# EAGLE board iMX233-OLINUXINO-MINI_Rev_C (EAGLE 7.2.0), part 1 of 3
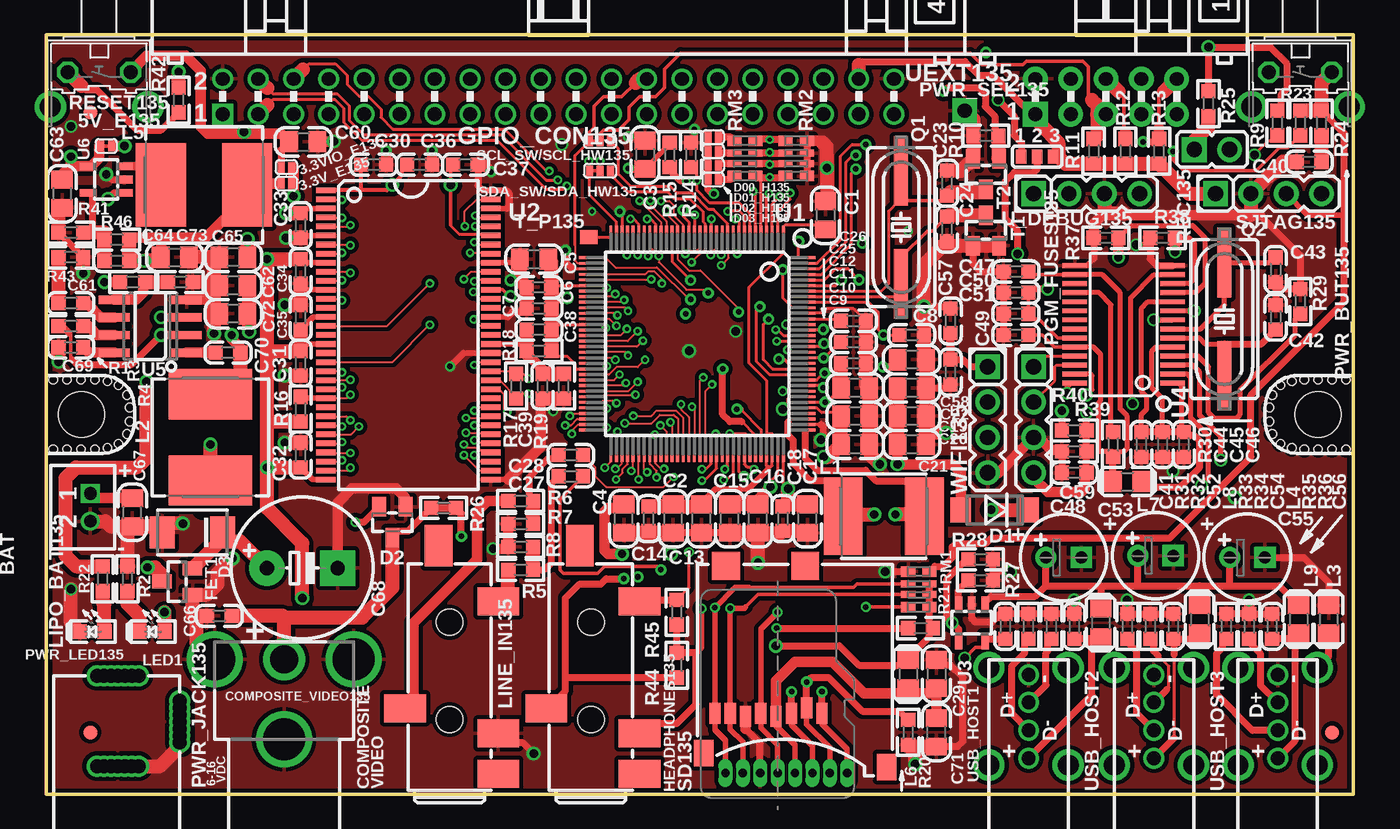
[diagram p1: board, top side]
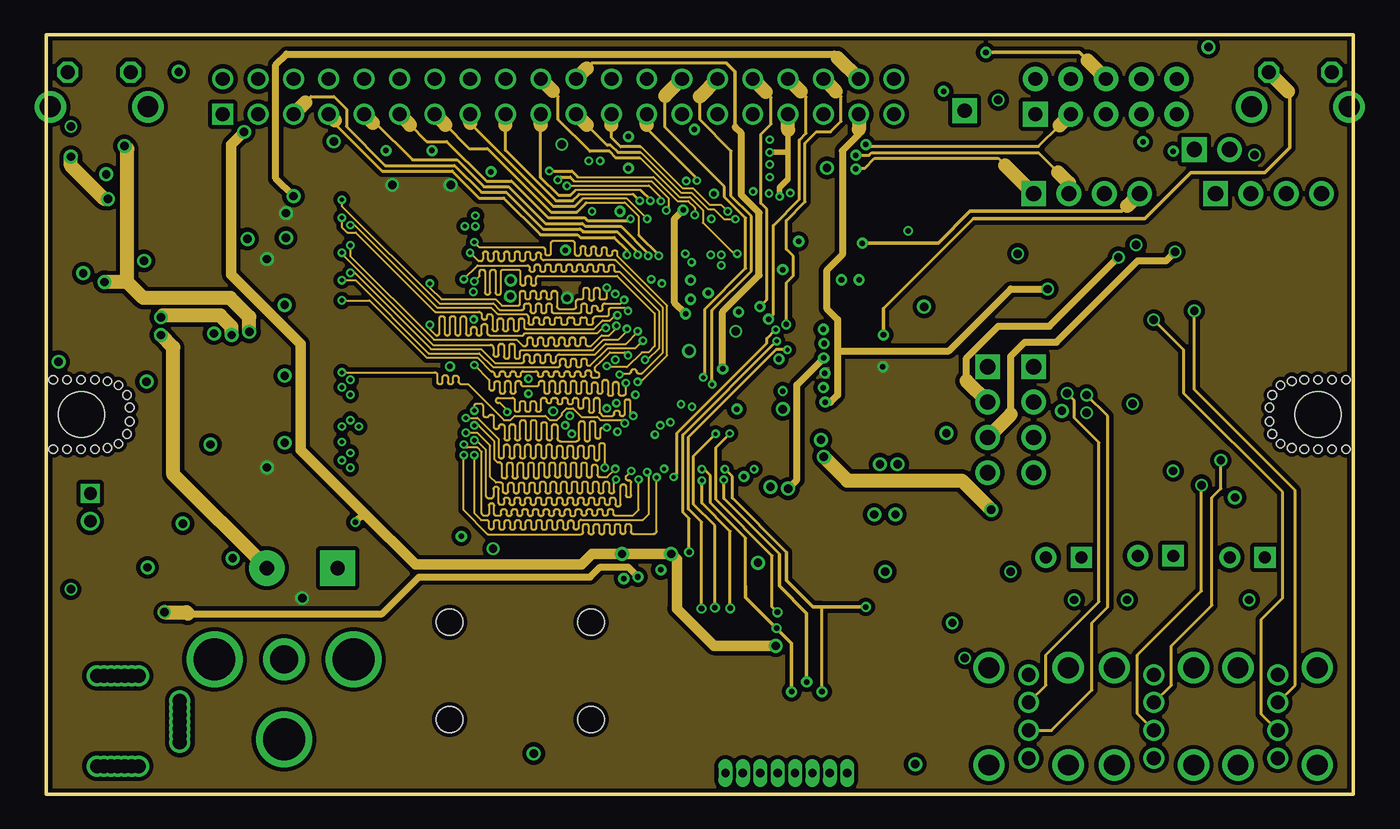
[diagram p2: board, inner layer Route2]
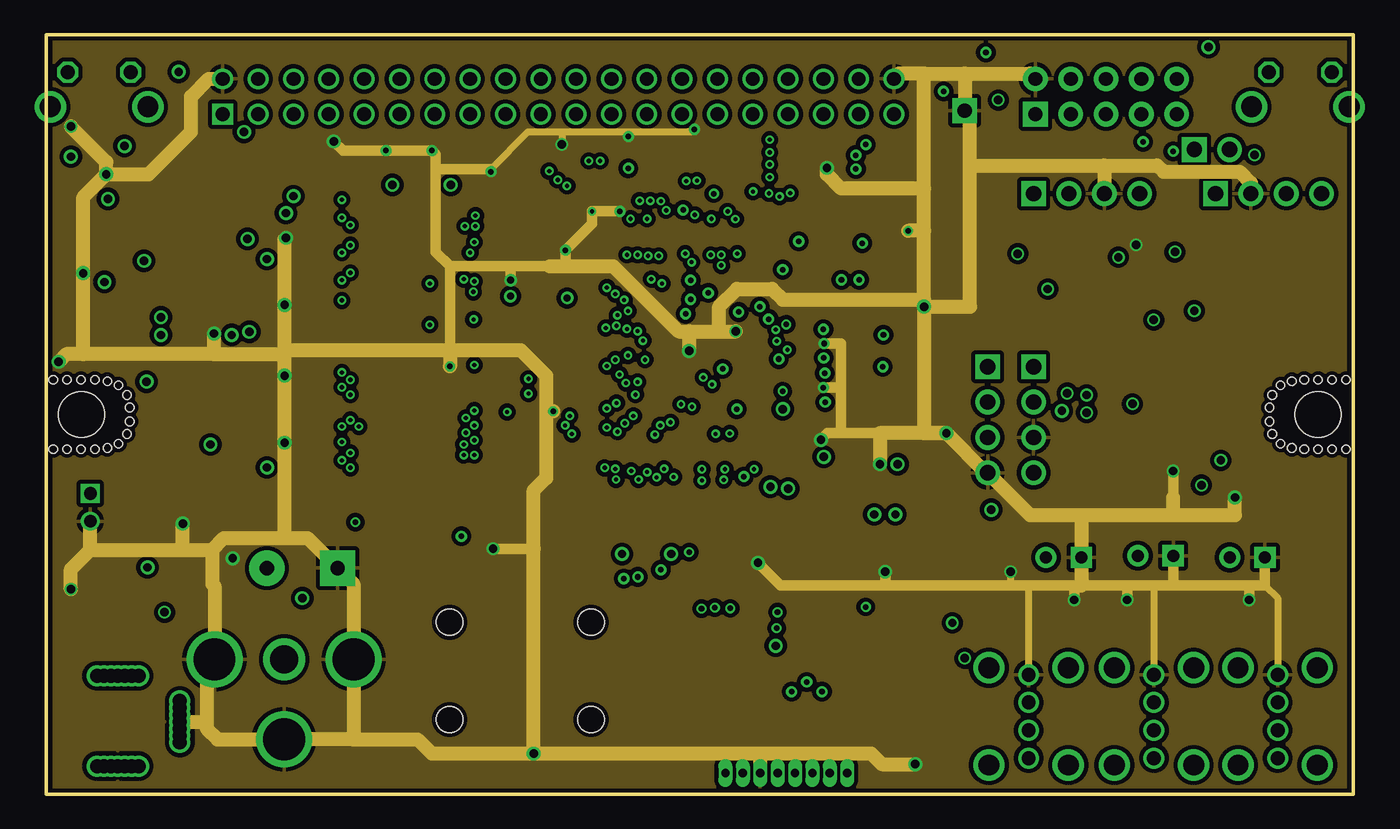
[diagram p3: board, inner layer Route15]
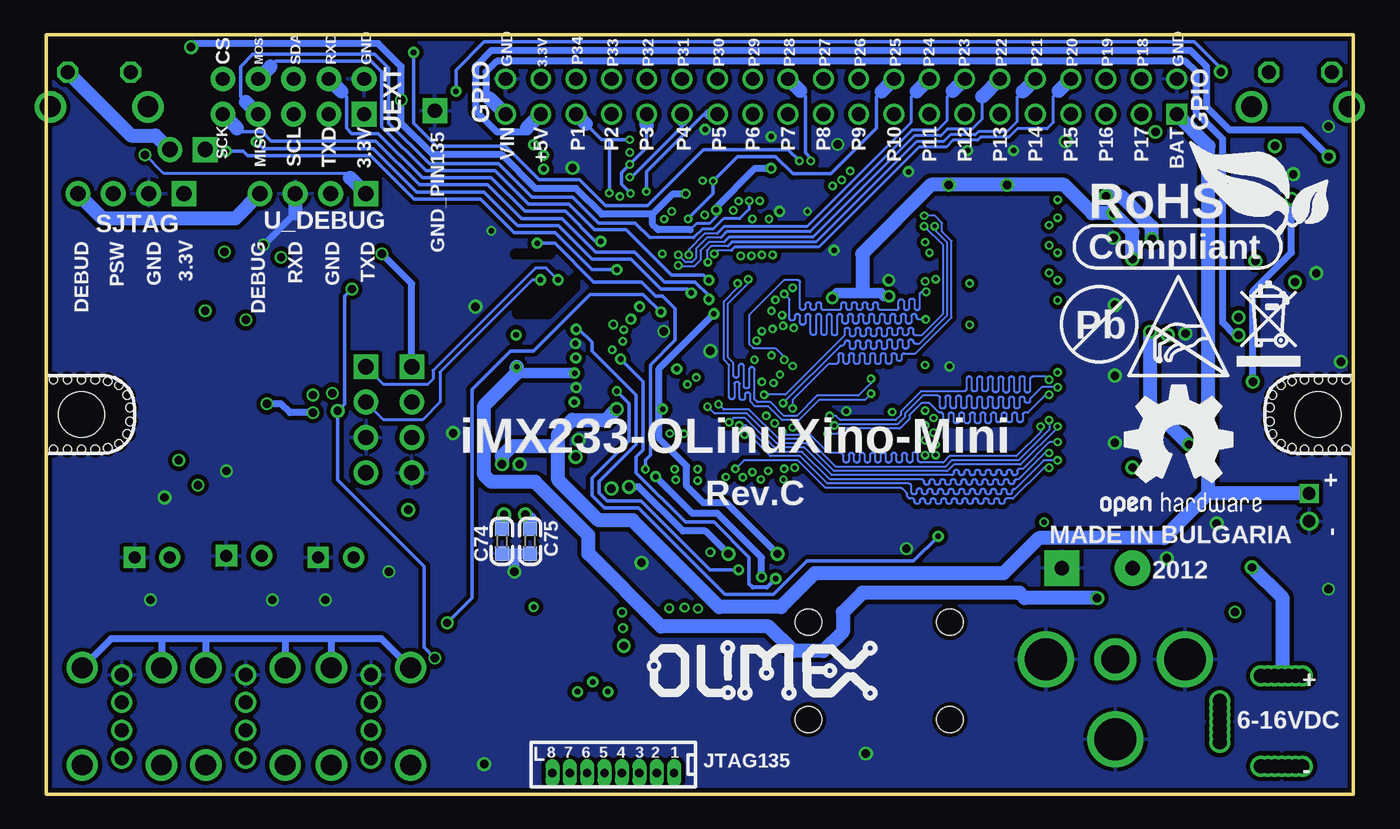
[diagram p4: board, bottom side, seen from below]

Size 93.98 x 54.61 mm. Coordinates in mm from the lower left corner, seen from the top.
Copper layers (1*2*15*16): Top 0.035mm / dielectric 0.5mm / Route2 0.035mm / dielectric 0.5mm / Route15 0.035mm / dielectric 0.5mm / Bottom 0.035mm
Design rules "default": minimum track width 6mil, minimum drill 0.3mm, track to track 0.1499mm, track to pad 6mil, pad to pad 6mil, via to via 6mil, smd to smd 1mil, copper to edge 10mil, drill to drill 8mil, minimum pad ring 6mil, minimum via ring 6mil, stop-mask expansion 4mil, vias tented up to drill 25mil, thermal gap 12mil
Net classes: 1 pwr: width 0.5 mm, clearance 0.2 mm
tRestrict: 6 lines
bRestrict: 4 lines

## Footprints (pad centres in the part's own frame; a part is rotated, then mirrored left to right if it is on the bottom)
SJ_1_SMALLER = smd 0.508 x 0.762: 1 -0.381,0; 2 0.381,0
SJ_1_SMALLER_CLOSE = smd 0.508 x 0.762: 1 -0.381,0; 2 0.381,0
C0805_5MIL_DWS = smd 1.27 x 1.524: 1 -1.016,0; 2 1.016,0
C0603_DWS = smd 1.016 x 1.016: 1 -0.889,0; 2 0.889,0
E2,5-6,3 = drill 0.864 pad 1.524: + -1.27,0 | drill 0.864 pad 1.524 square: - 1.27,0
E5-10,5 = drill 1.016 pad 2.54: + -2.54,0 | drill 1.016 pad 2.54 square: - 2.54,0
VIDEO_CON = drill 3: GND1 -5,-5.75; GND2 0,0; GND3 5,-5.75 | drill 2: IO 0,-5.75
MLL-41 = smd 1.45 x 1.8: A 2.445,0; K -2.445,0
SOT23C(BAT54S) = smd 1 x 1.4: 1 -0.95,-1.1; 2 0.95,-1.1; 3 0,1.1
DO214AA = smd 1.778 x 2.286: A 2.177,0; C -2.177,0
SOT23 = smd 1 x 1.4: 1 -0.95,-1.1; 2 0.95,-1.1; 3 0,1.1
TEST_PAD40/70/SQUARE = drill 1.016 pad 1.778 square: P$1 0,0
BH40R = drill 1 square: 1 -24.13,-1.27 | drill 1: 2 -24.13,1.27; 3 -21.59,-1.27; 4 -21.59,1.27; 5 -19.05,-1.27; 6 -19.05,1.27; 7 -16.51,-1.27; 8 -16.51,1.27; 9 -13.97,-1.27; 10 -13.97,1.27; 11 -11.43,-1.27; 12 -11.43,1.27; 13 -8.89,-1.27; 14 -8.89,1.27; 15 -6.35,-1.27; 16 -6.35,1.27; 17 -3.81,-1.27; 18 -3.81,1.27; 19 -1.27,-1.27; 20 -1.27,1.27; 21 1.27,-1.27; 22 1.27,1.27; 23 3.81,-1.27; 24 3.81,1.27; 25 6.35,-1.27; 26 6.35,1.27; 27 8.89,-1.27; 28 8.89,1.27; 29 11.43,-1.27; 30 11.43,1.27; 31 13.97,-1.27; 32 13.97,1.27; 33 16.51,-1.27; 34 16.51,1.27; 35 19.05,-1.27; 36 19.05,1.27; 37 21.59,-1.27; 38 21.59,1.27; 39 24.13,-1.27; 40 24.13,1.27
PJ-W47S-05D2-LF_5PIN_V2 = smd 2 x 3: 1 2.1,-0.5; 2 14.5,-0.5; 3 6.8,6.2; 5 5,-0.5 | smd 3 x 2: 4 18.5,3.8 | hole 1.9: 6,3; 13,3
WU08S = drill 0.6 pad 0.991 long: 1 -4.375,0; 2 -3.125,0; 3 -1.875,0; 4 -0.625,0; 5 0.625,0; 6 1.875,0; 7 3.125,0; 8 4.375,0
CD53 = smd 2.794 x 5.588: 1 -2.921,0; 2 2.921,0
8X8MM_3131 = smd 3.6 x 6: 1 -3.1,0; 2 3.1,0
L0805_5MIL_DWS = smd 1.27 x 1.524: 1 -1.016,0; 2 1.016,0
LED-0603 = smd 1.016 x 1.016: A 0.889,0; C -0.889,0
DW02S = drill 0.9 square: 1 -1,0 | drill 0.9: 2 1,0
HN1X4 = drill 1.1 pad 1.778 square: 1 -3.81,0 | drill 1.1 pad 1.778: 2 -1.27,0; 3 1.27,0; 4 3.81,0
B3F-31XX = drill 1.016 octagon: 1 -2.261,-1.245; 2 2.261,-1.245 | drill 1.499 pad 2.159: 3 -3.505,1.245; 4 3.505,1.245
PWR_JACK_UNI_MILLING = drill 1: + 0,4.75; +1 0,5.25; +2 0,5.75; +3 0,6.25; +4 0,4.25; +5 0,3.75; +6 0,3.25; - -6.5,4.75; -1 -6.5,5.25; -2 -6.5,5.75; -3 -6.5,4.25; -4 -6.5,3.75; -5 -6.5,6.25; -6 -6.5,3.25; -- -3.3,0.3; --1 -3.8,0.3; --2 -4.3,0.3; --3 -4.8,0.3; --4 -2.8,0.3; --5 -2.3,0.3; --6 -1.8,0.3
SJ_2_SMALL = smd 0.762 x 1.016: 1 -1.143,0; 2 0,0; 3 1.143,0
HC49/SMD2_THIN = smd 5 x 1: 1 -4.064,0; 2 4.064,0
R0603_5MIL_DWS = smd 1.016 x 1.016: 1 -0.889,0; 2 0.889,0
R0603_5MIL_DWS_NA = smd 1.016 x 1.016: 1 -0.889,0; 2 0.889,0
0603_0R = smd 1.016 x 1.016: 1 -0.889,0; 2 0.889,0
JP1 = drill 1.1 pad 1.778 square: 1 0,-1.27 | drill 1.1 pad 1.778: 2 0,1.27
R_MATRIX_4 = smd 1.016 x 0.762: 1.1 -0.762,1.27; 1.2 0.762,1.27; 4.1 -0.762,-1.27; 4.2 0.762,-1.27 | smd 1.016 x 0.508: 2.1 -0.762,0.381; 2.2 0.762,0.381; 3.1 -0.762,-0.381; 3.2 0.762,-0.381
SJ_2_SMALLER = smd 0.508 x 0.762: 1 -0.762,0; 2 0,0; 3 0.762,0
TFR-MEM-CON = smd 0.8 x 1.5: 1 -3.2,10.7; 2 -2.1,10.3; 3 -1,10.7; 4 0.1,10.9; 5 1.2,10.7; 6 2.3,10.9; 7 3.4,10.7; 8 4.5,10.7 | smd 2 x 2: 9 3.7,0.1; 10 -2,0.1 | smd 1.4 x 1.9: 11 5.3,13.55; 12 -7.85,14.55
SMD50/40 = smd 1.27 x 1.016: P$1 0,0
TQFP128LD = smd 0.2 x 1.5: 1 -6.2,-7.75; 2 -5.8,-7.75; 3 -5.4,-7.75; 4 -5,-7.75; 5 -4.6,-7.75; 6 -4.2,-7.75; 7 -3.8,-7.75; 8 -3.4,-7.75; 9 -3,-7.75; 10 -2.6,-7.75; 11 -2.2,-7.75; 12 -1.8,-7.75; 13 -1.4,-7.75; 14 -1,-7.75; 15 -0.6,-7.75; 16 -0.2,-7.75; 17 0.2,-7.75; 18 0.6,-7.75; 19 1,-7.75; 20 1.4,-7.75; 21 1.8,-7.75; 22 2.2,-7.75; 23 2.6,-7.75; 24 3,-7.75; 25 3.4,-7.75; 26 3.8,-7.75; 27 4.2,-7.75; 28 4.6,-7.75; 29 5,-7.75; 30 5.4,-7.75; 31 5.8,-7.75; 32 6.2,-7.75; 65 6.2,7.75; 66 5.8,7.75; 67 5.4,7.75; 68 5,7.75; 69 4.6,7.75; 70 4.2,7.75; 71 3.8,7.75; 72 3.4,7.75; 73 3,7.75; 74 2.6,7.75; 75 2.2,7.75; 76 1.8,7.75; 77 1.4,7.75; 78 1,7.75; 79 0.6,7.75; 80 0.2,7.75; 81 -0.2,7.75; 82 -0.6,7.75; 83 -1,7.75; 84 -1.4,7.75; 85 -1.8,7.75; 86 -2.2,7.75; 87 -2.6,7.75; 88 -3,7.75; 89 -3.4,7.75; 90 -3.8,7.75; 91 -4.2,7.75; 92 -4.6,7.75; 93 -5,7.75; 94 -5.4,7.75; 95 -5.8,7.75; 96 -6.2,7.75 | smd 1.5 x 0.2: 33 7.75,-6.2; 34 7.75,-5.8; 35 7.75,-5.4; 36 7.75,-5; 37 7.75,-4.6; 38 7.75,-4.2; 39 7.75,-3.8; 40 7.75,-3.4; 41 7.75,-3; 42 7.75,-2.6; 43 7.75,-2.2; 44 7.75,-1.8; 45 7.75,-1.4; 46 7.75,-1; 47 7.75,-0.6; 48 7.75,-0.2; 49 7.75,0.2; 50 7.75,0.6; 51 7.75,1; 52 7.75,1.4; 53 7.75,1.8; 54 7.75,2.2; 55 7.75,2.6; 56 7.75,3; 57 7.75,3.4; 58 7.75,3.8; 59 7.75,4.2; 60 7.75,4.6; 61 7.75,5; 62 7.75,5.4; 63 7.75,5.8; 64 7.75,6.2; 97 -7.75,6.2; 98 -7.75,5.8; 99 -7.75,5.4; 100 -7.75,5; 101 -7.75,4.6; 102 -7.75,4.2; 103 -7.75,3.8; 104 -7.75,3.4; 105 -7.75,3; 106 -7.75,2.6; 107 -7.75,2.2; 108 -7.75,1.8; 109 -7.75,1.4; 110 -7.75,1; 111 -7.75,0.6; 112 -7.75,0.2; 113 -7.75,-0.2; 114 -7.75,-0.6; 115 -7.75,-1; 116 -7.75,-1.4; 117 -7.75,-1.8; 118 -7.75,-2.2; 119 -7.75,-2.6; 120 -7.75,-3; 121 -7.75,-3.4; 122 -7.75,-3.8; 123 -7.75,-4.2; 124 -7.75,-4.6; 125 -7.75,-5; 126 -7.75,-5.4; 127 -7.75,-5.8; 128 -7.75,-6.2
66TSOP-II = smd 0.4 x 1.4: 1 -10.4,-5.925; 2 -9.75,-5.925; 3 -9.1,-5.925; 4 -8.45,-5.925; 5 -7.8,-5.925; 6 -7.15,-5.925; 7 -6.5,-5.925; 8 -5.85,-5.925; 9 -5.2,-5.925; 10 -4.55,-5.925; 11 -3.9,-5.925; 12 -3.25,-5.925; 13 -2.6,-5.925; 14 -1.95,-5.925; 15 -1.3,-5.925; 16 -0.65,-5.925; 17 0,-5.925; 18 0.65,-5.925; 19 1.3,-5.925; 20 1.95,-5.925; 21 2.6,-5.925; 22 3.25,-5.925; 23 3.9,-5.925; 24 4.55,-5.925; 25 5.2,-5.925; 26 5.85,-5.925; 27 6.5,-5.925; 28 7.15,-5.925; 29 7.8,-5.925; 30 8.45,-5.925; 31 9.1,-5.925; 32 9.75,-5.925; 33 10.4,-5.925; 34 10.4,5.925; 35 9.75,5.925; 36 9.1,5.925; 37 8.45,5.925; 38 7.8,5.925; 39 7.15,5.925; 40 6.5,5.925; 41 5.85,5.925; 42 5.2,5.925; 43 4.55,5.925; 44 3.9,5.925; 45 3.25,5.925; 46 2.6,5.925; 47 1.95,5.925; 48 1.3,5.925; 49 0.65,5.925; 50 0,5.925; 51 -0.65,5.925; 52 -1.3,5.925; 53 -1.95,5.925; 54 -2.6,5.925; 55 -3.25,5.925; 56 -3.9,5.925; 57 -4.55,5.925; 58 -5.2,5.925; 59 -5.85,5.925; 60 -6.5,5.925; 61 -7.15,5.925; 62 -7.8,5.925; 63 -8.45,5.925; 64 -9.1,5.925; 65 -9.75,5.925; 66 -10.4,5.925
SOT23-5 = smd 0.55 x 1.2: 1 -0.95,-1.3; 2 0,-1.3; 3 0.95,-1.3; 4 0.95,1.3; 5 -0.95,1.3
SSOP28 = smd 0.35 x 1.75: 1 -4.225,-3.525; 2 -3.575,-3.525; 3 -2.925,-3.525; 4 -2.275,-3.525; 5 -1.625,-3.525; 6 -0.975,-3.525; 7 -0.325,-3.525; 8 0.325,-3.525; 9 0.975,-3.525; 10 1.625,-3.525; 11 2.275,-3.525; 12 2.925,-3.525; 13 3.575,-3.525; 14 4.225,-3.525; 15 4.225,3.525; 16 3.575,3.525; 17 2.925,3.525; 18 2.275,3.525; 19 1.625,3.525; 20 0.975,3.525; 21 0.325,3.525; 22 -0.325,3.525; 23 -0.975,3.525; 24 -1.625,3.525; 25 -2.275,3.525; 26 -2.925,3.525; 27 -3.575,3.525; 28 -4.225,3.525
SOIC8 = smd 0.6 x 2.2: 1 -1.905,-2.6; 2 -0.635,-2.6; 3 0.635,-2.6; 4 1.905,-2.6; 5 1.905,2.6; 6 0.635,2.6; 7 -0.635,2.6; 8 -1.905,2.6
FIDUCIAL-1X2 = smd 1 x 1: 1 0,0
JM42_PACTEC-101X61X25_MILLED = hole 3.3: 2.54,27.305; 91.44,27.305 | hole 0.6: 0.5,24.8; 1.5,24.8; 2.5,24.8; 3.5,24.8; 4.4,24.9; 0.5,29.8; 1.5,29.8; 2.5,29.8; 3.5,29.8; 4.4,29.7; 5.2,25.2; 5.2,29.4; 5.8,28.7; 5.8,25.9; 6,26.8; 6,27.8; 93.45,29.8; 92.45,29.8; 91.45,29.8; 90.45,29.8; 89.55,29.7; 93.45,24.8; 92.45,24.8; 91.45,24.8; 90.45,24.8; 89.55,24.9; 88.75,29.4; 88.75,25.2; 88.15,25.9; 88.15,28.7; 87.95,27.8; 87.95,26.8
BH10R = drill 1 pad 1.778 square: 1 -5.08,-1.27 | drill 1 pad 1.778: 2 -5.08,1.27; 3 -2.54,-1.27; 4 -2.54,1.27; 5 0,-1.27; 6 0,1.27; 7 2.54,-1.27; 8 2.54,1.27; 9 5.08,-1.27; 10 5.08,1.27
USB_A_VERTICAL_PTH = drill 1: 1 3.45,12.75; 2 3.45,14.75; 3 3.45,16.75; 4 3.45,18.75 | drill 1.5: P$1 0.6,12.25; P$2 6.3,12.25; P$3 6.3,19.25; P$4 0.6,19.25

## Placement (x,y rotation side)
3.3V_E135  Open  [SJ_1_SMALLER]  17.27,43.92 0 top
3.3VIO_E135  Close  [SJ_1_SMALLER]  17.27,45.09 180 top
5V_E135  Close  [SJ_1_SMALLER_CLOSE]  4.32,46.61 180 top
C1  22uF/6.3V  [C0805_5MIL_DWS]  56.03,41.63 270 top
C2  22uF/6.3V  [C0805_5MIL_DWS]  45.09,19.81 90 top
C3  22uF/6.3V  [C0805_5MIL_DWS]  43.05,45.97 270 top
C4  22uF/6.3V  [C0805_5MIL_DWS]  41.53,19.81 90 top
C5  22uF/6.3V  [C0805_5MIL_DWS]  35.08,38.48 0 top
C6  100nF  [C0603_DWS]  35.43,36.45 0 top
C7  100nF  [C0603_DWS]  35.43,34.92 0 top
C8  100nF  [C0603_DWS]  62.23,33.02 180 top
C9  22uF/6.3V  [C0805_5MIL_DWS]  58.17,25.15 180 top
C10  22uF/6.3V  [C0805_5MIL_DWS]  58.17,27.18 180 top
C11  22uF/6.3V  [C0805_5MIL_DWS]  58.17,29.21 180 top
C12  100nF  [C0603_DWS]  58.04,30.99 180 top
C13  22uF/6.3V  [C0805_5MIL_DWS]  47.12,19.81 90 top
C14  100nF  [C0603_DWS]  43.31,19.81 90 top
C15  22uF/6.3V  [C0805_5MIL_DWS]  49.15,19.81 90 top
C16  22uF/6.3V  [C0805_5MIL_DWS]  51.18,19.81 90 top
C17  22uF/6.3V  [C0805_5MIL_DWS]  54.74,19.81 90 top
C18  100nF  [C0603_DWS]  52.96,19.81 90 top
C19  22uF/6.3V  [C0805_5MIL_DWS]  62.23,29.21 180 top
C20  22uF/6.3V  [C0805_5MIL_DWS]  62.23,27.18 180 top
C21  22uF/6.3V  [C0805_5MIL_DWS]  62.23,25.15 180 top
C22  22uF/6.3V  [C0805_5MIL_DWS]  62.23,31.24 180 top
C23  33pF  [C0603_DWS]  64.77,43.94 270 top
C24  33pF  [C0603_DWS]  64.77,40.64 90 top
C25  100nF  [C0603_DWS]  58.04,32.51 180 top
C26  1uF  [C0603_DWS]  58.04,34.04 180 top
C27  1uF  [C0603_DWS]  37.72,22.86 0 top
C28  1uF  [C0603_DWS]  37.72,24.38 0 top
C29  22uF/6.3V  [C0805_5MIL_DWS]  64.01,8.64 270 top
C30  100nF  [C0603_DWS]  23.55,45.26 180 top
C31  100nF  [C0603_DWS]  18.29,30.99 90 top
C32  100nF  [C0603_DWS]  18.29,24.38 270 top
C33  100nF  [C0603_DWS]  18.29,40.89 90 top
C34  100nF  [C0603_DWS]  18.29,37.59 90 top
C35  10uF/6.3V  [C0603_DWS]  18.29,34.29 270 top
C36  100nF  [C0603_DWS]  26.85,45.26 180 top
C37  10uF/6.3V  [C0603_DWS]  30.15,45.26 180 top
C38  100nF  [C0603_DWS]  35.43,33.4 180 top
C39  100nF  [C0603_DWS]  35.69,29.34 90 top
C40  100nF  [C0603_DWS]  90.81,45.47 180 top
C41  10uF/6.3V  [C0603_DWS]  68.96,12.06 90 top
C42  33pF  [C0603_DWS]  88.39,34.29 270 top
C43  33pF  [C0603_DWS]  88.39,37.72 90 top
C44  100nF  [C0603_DWS]  78.74,25.15 270 top
C45  100nF  [C0603_DWS]  80.26,25.15 270 top
C46  100nF  [C0603_DWS]  81.79,25.15 270 top
C47  10uF/6.3V  [C0603_DWS]  69.72,37.59 180 top
C48  100uF/16V/LOWESR/105C/6.3x11mm_RM2.5  [E2,5-6,3]  73.15,17.02 0 top
C49  100nF  [C0603_DWS]  69.72,33.02 180 top
C50  10uF/6.3V  [C0603_DWS]  69.72,36.07 180 top
C51  100nF  [C0603_DWS]  69.72,34.54 180 top
C52  100nF  [C0603_DWS]  73.91,12.06 90 top
C53  100uF/16V/LOWESR/105C/6.3x11mm_RM2.5  [E2,5-6,3]  79.76,17.14 0 top
C54  100nF  [C0603_DWS]  81.03,12.06 90 top
C55  100uF/16V/LOWESR/105C/6.3x11mm_RM2.5  [E2,5-6,3]  86.36,17.02 0 top
C56  100nF  [C0603_DWS]  88.14,12.06 90 top
C57  100nF  [C0603_DWS]  65.02,34.04 90 top
C58  10uF/6.3V  [C0603_DWS]  65.02,30.35 270 top
C59  1uF  [C0603_DWS]  73.91,23.11 0 top
C60  22uF/6.3V  [C0805_5MIL_DWS]  18.49,46.91 0 top
C61  3.3nF  [C0603_DWS]  1.78,35.31 180 top
C62  22uF/6.3V  [C0805_5MIL_DWS]  13.46,36.58 180 top
C63  22uF/6.3V  [C0805_5MIL_DWS]  1.14,43.18 270 top
C64  (NA)22pF  [C0603_DWS]  5.08,38.35 180 top
C65  22uF/6.3V  [C0805_5MIL_DWS]  13.46,38.61 180 top
C66  47pF  [C0603_DWS]  12.45,12.83 180 top
C67  22uF/6.3V  [C0805_5MIL_DWS]  6.2,20.27 90 top
C68  470uF/25V/LOWESR/105C  [E5-10,5]  18.41,16.26 0 top
C69  100nF  [C0603_DWS]  1.78,32.13 180 top
C70  10nF  [C0603_DWS]  13.08,31.75 0 top
C71  22uF/6.3V  [C0805_5MIL_DWS]  64.01,4.45 90 top
C72  22uF/6.3V  [C0805_5MIL_DWS]  13.46,34.54 180 top
C73  NA(22uF/6.3V)  [C0805_5MIL_DWS]  9.25,38.61 0 top
C74  NA  [C0603_DWS]  61.21,18.19 90 bottom
C75  10pF  [C0603_DWS]  59.18,18.19 90 bottom
COMPOSITE_VIDEO135  VIDEO_CON  [VIDEO_CON]  17.1,3.94 180 top
D00_H135  Close  [SJ_1_SMALLER]  47.96,47.24 180 top
D1  1N5819(SS14)  [MLL-41]  68.2,20.45 180 top
D01_H135  Open  [SJ_1_SMALLER]  47.96,46.23 180 top
D2  BAT54S  [SOT23C(BAT54S)]  24.89,19.56 180 top
D02_H135  Open  [SJ_1_SMALLER]  47.96,45.21 180 top
D3  SMBJ16A  [DO214AA]  10.52,18.82 180 top
D03_H135  Close  [SJ_1_SMALLER]  47.96,44.2 180 top
FET1  IRLML6402  [SOT23]  9.42,15.29 90 top
GND_PIN135  TESTPAD3  [TEST_PAD40/70/SQUARE]  66.04,49.15 0 bottom
GPIO_CON135  BH40R  [BH40R]  36.83,50.16 0 top
HEADPHONES135  PJ-W47S-05D2-LF_V2  [PJ-W47S-05D2-LF_5PIN_V2]  42.16,-0.64 90 top
JTAG135  NA(WU08S)  [WU08S]  53.21,1.52 180 bottom
L1  22uH/1.3A/SW68  [CD53]  60.22,19.99 0 top
L2  10uH/2.3A/YS75/7x8  [8X8MM_3131]  11.81,25.65 270 top
L3  FB0805/600R/200mA(201209-601)  [L0805_5MIL_DWS]  92.2,12.57 270 top
L4  FB0805/600R/2A  [L0805_5MIL_DWS]  82.93,12.57 270 top
L5  NA(2.2uH/3A/YS75/7x8)  [8X8MM_3131]  11.35,43.81 0 top
L6  CL470nH/0805/1.76R/250mA  [L0805_5MIL_DWS]  61.98,8.64 270 top
L7  FB0805/600R/2A  [L0805_5MIL_DWS]  77.72,22.48 0 top
L8  FB0805/600R/2A  [L0805_5MIL_DWS]  75.82,12.32 270 top
L9  FB0805/600R/2A  [L0805_5MIL_DWS]  90.04,12.57 270 top
LED1  LED/GREEN/0603  [LED-0603]  7.62,11.68 0 top
LINE_IN135  PJ-W47S-05D2-LF_V2  [PJ-W47S-05D2-LF_5PIN_V2]  32,-0.64 90 top
LIPO_BAT135  DW02S  [DW02S]  3.17,20.62 270 top
PGM_FUSES135  NA(HN1X4)  [HN1X4]  70.99,26.92 270 top
PWR_BUT135  TV-06B  [B3F-31XX]  90.17,50.67 180 top
PWR_JACK135  YDJ-1136  [PWR_JACK_UNI_MILLING]  9.91,8.51 90 top
PWR_LED135  LED/RED/0603  [LED-0603]  3.3,11.68 0 top
PWR_SEL135  1-2:Closed  [SJ_2_SMALL]  71.25,45.85 0 top
Q1  Q24.000MHz/HC-49SM/SMD/20ppm/20pF  [HC49/SMD2_THIN]  61.47,40.77 90 top
Q2  Q12.000MHz/HC-49SM/SMD/20ppm/20pF  [HC49/SMD2_THIN]  84.71,34.16 270 top
R1  47k  [R0603_5MIL_DWS]  1.78,33.66 0 top
R2  680R/1%  [R0603_5MIL_DWS]  5.84,15.49 270 top
R3  4.99k/1%  [R0603_5MIL_DWS]  6.22,36.83 180 top
R4  1.1k/1%  [R0603_5MIL_DWS]  9.65,36.83 0 top
R5  10k  [R0603_5MIL_DWS]  34.11,16.13 180 top
R6  10k  [R0603_5MIL_DWS]  34.11,21.08 180 top
R7  4.7k  [R0603_5MIL_DWS]  34.11,19.43 0 top
R8  4.7k  [R0603_5MIL_DWS]  34.11,17.78 0 top
R9  100k  [R0603_5MIL_DWS]  88.52,48.26 90 top
R10  47k  [R0603_5MIL_DWS]  67.56,47.35 180 top
R11  2.2k  [R0603_5MIL_DWS]  75.31,46.23 270 top
R12  2.2k  [R0603_5MIL_DWS]  77.6,46.23 270 top
R13  47k  [R0603_5MIL_DWS]  80.01,46.23 270 top
R14  NA(47k)  [R0603_5MIL_DWS]  46.35,45.97 270 top
R15  47k  [R0603_5MIL_DWS]  44.83,45.97 270 top
R16  10k  [R0603_5MIL_DWS]  18.29,27.69 270 top
R17  120R  [R0603_5MIL_DWS]  33.78,29.34 270 top
R18  1k/1%  [R0603_5MIL_DWS]  35.43,31.88 0 top
R19  1k/1%  [R0603_5MIL_DWS]  37.21,29.34 90 top
R20  1M  [R0603_5MIL_DWS]  61.98,4.45 270 top
R21  10k  [R0603_5MIL_DWS]  62.87,11.94 0 top
R22  1k  [R0603_5MIL_DWS]  4.06,15.49 270 top
R23  1k  [R0603_5MIL_DWS]  90.17,48.26 90 top
R24  1k  [R0603_5MIL_DWS]  91.69,48.26 90 top
R25  10k  [R0603_5MIL_DWS_NA]  83.57,49.66 90 top
R26  0R(Board_Mounted)  [0603_0R]  28.57,20.57 180 top
R27  10k  [R0603_5MIL_DWS]  67.18,15.37 180 top
R28  10k  [R0603_5MIL_DWS]  67.18,16.89 180 top
R29  680R/1%  [R0603_5MIL_DWS]  90.17,35.43 270 top
R30  100k  [R0603_5MIL_DWS]  76.71,25.15 90 top
R31  NA  [R0603_5MIL_DWS]  70.61,12.06 270 top
R32  NA  [R0603_5MIL_DWS]  72.26,12.06 270 top
R33  NA  [R0603_5MIL_DWS]  77.72,12.06 270 top
R34  NA  [R0603_5MIL_DWS]  79.38,12.06 270 top
R35  NA  [R0603_5MIL_DWS]  84.84,12.06 270 top
R36  NA  [R0603_5MIL_DWS]  86.49,12.06 270 top
R37  NA  [R0603_5MIL_DWS]  76.2,40.01 0 top
R38  NA  [R0603_5MIL_DWS]  80.26,40.01 0 top
R39  47k  [R0603_5MIL_DWS]  73.91,24.64 180 top
R40  10k  [R0603_5MIL_DWS]  73.91,26.16 180 top
R41  NA(1.1k/1%)  [R0603_5MIL_DWS]  1.78,40.39 180 top
R42  47k  [R0603_5MIL_DWS]  9.53,49.91 270 top
R43  2.2k  [R0603_5MIL_DWS]  1.78,38.61 0 top
R44  120R  [R0603_5MIL_DWS]  45.34,9.27 270 top
R45  120R  [R0603_5MIL_DWS]  45.34,13.08 90 top
R46  (NA)4.99k/1%  [R0603_5MIL_DWS]  5.08,39.88 180 top
REC135  NA(HN1x2)  [JP1]  83.82,46.35 270 top
RESET135  TV-06B  [B3F-31XX]  3.81,50.67 180 top
RM1  RA1206_(4X0603)_4B8_100K  [R_MATRIX_4]  62.74,14.73 0 top
RM2  RA1206_(4X0603)_4B8_47K  [R_MATRIX_4]  53.92,45.72 180 top
RM3  RA1206_(4X0603)_4B8_4.7K  [R_MATRIX_4]  50.24,45.72 180 top
SCL_SW/SCL_HW135  SCL_SW:Close/SCL_HW:Open  [SJ_2_SMALLER]  39.83,46.96 180 top
SD135  MICRO  [TFR-MEM-CON]  52.58,16.51 180 top
SDA_SW/SDA_HW135  SDA_SW:Close/SDA_HW:Open  [SJ_2_SMALLER]  39.83,44.83 180 top
SJTAG135  (NA)HN1X4  [HN1X4]  87.88,43.18 0 top
T1  BC846B  [SOT23]  67.56,40.54 0 top
T2  BC846B  [SOT23]  67.56,44.58 180 top
T_P135  TESTPAD50/40  [SMD50/40]  39.01,40.06 0 top
U1  MCIMX233CAG4C  [TQFP128LD]  46.8,32.38 180 top
U2  HY5DU121622D(L)T(P)-J  [66TSOP-II]  26.04,33.02 270 top
U3  SY6280  [SOT23-5]  66.55,12.32 180 top
U4  GL850G  [SSOP28]  77.47,33.78 90 top
U5  MP1482DS  [SOIC8]  7.49,33.66 90 top
U6  (NA)SY8008C(AA)C  [SOT23-5]  4.32,44.2 90 top
U$1  FIDUCIAL1X2  [FIDUCIAL-1X2]  3.17,4.45 180 top
U$2  FIDUCIAL1X2  [FIDUCIAL-1X2]  92.46,4.45 180 top
U$3  FIDUCIAL1X2  [FIDUCIAL-1X2]  3.17,49.02 180 top
U$5  [LOGO-OPENHARDWARE_8X8]  12.57,25.4 0 bottom
U$6  [JM42_PACTEC-101X61X25_MILLED]  0,0 0 top
U$8  [OLIMEX1_V]  33.04,6.63 0 bottom
U$9  [PB]  18.29,33.78 0 bottom
U$10  [ESD_SYMBOL]  16.13,30.1 0 bottom
U$11  [RECYCLE_BIN1/8]  8.38,30.73 0 bottom
U$12  [ROHS]  19.05,38.48 0 bottom
U_DEBUG135  HN1X4  [HN1X4]  74.8,43.18 0 top
UEXT135  BH10R  [BH10R]  76.2,50.16 0 top
USB_HOST1  USB_A_VERTICAL  [USB_A_VERTICAL_PTH]  67.18,-10.16 0 top
USB_HOST2  USB_A_VERTICAL  [USB_A_VERTICAL_PTH]  76.2,-10.16 0 top
USB_HOST3  USB_A_VERTICAL  [USB_A_VERTICAL_PTH]  85.09,-10.16 0 top
WIFI135  HN1X4  [HN1X4]  67.69,26.92 270 top

## Tracks (layer width: path | path; a pad name or v marks a point on that pad's centre or on a via)
+5V  (via drill 0.4 pad 0.8, 0.6 pad 0.25, 0.6 pad 1)
  Top 0.203: U1.102 55.99,28.18 v56.01,28.19 56.13,28.19 C11.2
  Top 0.254: U4.23 72.73,32.81 71.37,34.16 70.99,34.16 C51.1 C50.1 | U3.5 67.5,10.73 67.31,10.54 66.8,10.54 v66.04,9.78
  Top 0.508: U6.1 4.89,43.25 v4.45,42.8 | 3.81,46.61 5V_E135.2 | U3.5 67.5,11.11 67.56,11.18 C41.1 | v73.03,27.56 R40.2 | v72.01,36.32 70.87,36.32 C50.1
  Top 0.762: 3.81,46.61 3.81,45.72 3.24,45.15 U6.4 1.78,45.15 1.78,45.21 | v1.78,45.85 1.78,45.21 | C63.1 1.14,44.58 1.78,45.21
  Top 1.016: C11.2 C12.2 | R22.1 2.16,16.38 1.4,17.14 1.4,22.73 2.16,23.5 6.53,23.5 7.21,24.18 v7.21,29.67
  Route2 0.508: 58.42,47.8 58.42,47.45 57.25,46.27 57.25,38.79 56.11,37.65 56.11,34.92 56.9,34.14 56.9,31.88 | v56.01,28.19 56.39,28.19 56.9,28.7 56.9,31.88 | 56.9,31.88 64.9,31.88 69.34,36.32 v72.01,36.32
  Route2 1.016: GPIO_CON135.37 58.42,47.8 | v4.45,42.8 4.19,42.8 1.78,45.21 v1.78,45.85
  Bottom 0.254: v72.01,36.32 72.52,35.81 72.52,28.07 v73.03,27.56 73.03,22.61 66.8,16.38 66.8,10.54 v66.04,9.78
  Bottom 0.508: 59.44,47.88 59.69,47.62 61.59,47.62 63.12,49.15 63.12,52.32 61.98,53.47 11.68,53.47 10.54,52.32 10.54,49.4 8.89,47.75 3.68,47.75 v1.78,45.85 | v7.21,29.67 7.21,36.17 4.45,38.94 v4.45,42.8
  Bottom 1.016: 59.44,47.88 GPIO_CON135.37
+15V  (via drill 0.6 pad 1)
  Top 0.254: 1.14,33.66 R1.1 | 1.91,31.24 1.78,31.37 1.78,33.02 1.65,33.15
  Top 0.508: 1.65,33.15 1.14,33.66 | 1.91,31.24 2.29,30.86 6.1,30.86 v8.26,33.02
  Top 0.61: v8.26,33.02 U5.2
  Top 1.016: 12.69,18.19 12.47,18.19 FET1.2 | 12.69,18.19 D3.C | C68.+ 13.95,18.19 12.69,18.19
  Route2 1.016: v8.26,33.02 9.14,32.13 9.14,22.99 C68.+
  Bottom 0.508: v8.26,33.02 8.51,33.02 9.4,33.91 9.4,47.12 11.3,49.02 11.3,51.94 12.06,52.7 61.59,52.7 62.36,51.94 62.36,50.29 62.1,50.04
  Bottom 1.016: 62.1,50.04 GPIO_CON135.39
+24V  (via drill 0.6 pad 1)
  Top 0.203: U1.100 53.34,27.38 53.34,27.69 | v52.96,27.69 53.34,27.69 | U1.103 53.47,28.58 53.34,28.45 53.34,27.69
  Top 0.762: LIPO_BAT135.1 3.52,21.29 C67.2 | D1.A 65.75,23.15 65.18,23.72 v61.21,23.72 C21.2
  Top 1.016: C19.2 C20.2 C21.2
  Bottom 1.016: 10.41,21.62 10.41,46.61 GPIO_CON135.1 | 10.41,21.62 13.62,18.41 22.61,18.41 25.15,15.88 38.73,15.88 41.15,13.46 45.59,13.46 51.82,19.68 54.25,19.68 57.17,22.61 57.17,24.99 | LIPO_BAT135.1 10.41,21.62 | 57.17,24.99 60.53,24.99 61.21,24.31 v61.21,23.72 61.21,23.75 | v52.96,27.69 53.72,26.92 56.16,26.92 57.17,25.91 57.17,24.99
A0  (via drill 0.3 pad 0.5)
  Top 0.152: U1.76 45,26.63 v44.88,26.75 | U2.29 21.16,25.22 v21.26,25.32
  Bottom 0.152: v21.26,25.32 21.84,25.32 23.77,23.39 24,23.39 arc-90 24.16,23.24 24.16,23.09 arc90 24.31,22.94 24.38,22.94 arc90 24.54,23.09 24.54,23.16 arc-90 24.69,23.32 24.77,23.32 arc-90 24.92,23.16 24.92,23.09 arc90 25.07,22.94 25.15,22.94 arc90 25.3,23.09 25.3,23.16 arc-90 25.45,23.32 25.53,23.32 arc-90 25.68,23.16 25.68,23.09 arc90 25.83,22.94 25.91,22.94 arc90 26.06,23.09 26.06,23.16 arc-90 26.21,23.32 26.29,23.32 arc-90 26.44,23.16 26.44,23.09 arc90 26.59,22.94 26.67,22.94 arc90 26.82,23.09 26.82,23.16 arc-90 26.98,23.32 27.05,23.32 arc-90 27.2,23.16 27.2,23.09 arc90 27.36,22.94 27.43,22.94 arc90 27.58,23.09 27.58,23.16 arc-90 27.74,23.32 27.81,23.32 arc-90 27.96,23.16 27.96,23.09 arc90 28.12,22.94 28.19,22.94 arc90 28.35,23.09 28.35,23.16 arc-90 28.5,23.32 28.57,23.32 arc-90 28.73,23.16 28.73,23.09 arc90 28.88,22.94 37.49,22.94 39.47,24.92 41.6,24.92 43.74,27.05 44.58,27.05 v44.88,26.75
A1  (via drill 0.3 pad 0.5)
  Top 0.152: U2.30 20.14,24.54 v21.87,24.54 | U1.75 44.6,26.06 v44.15,26.52
  Bottom 0.152: v21.87,24.54 22.17,24.54 24.08,22.63 24.23,22.63 arc-90 24.38,22.48 24.38,22.43 arc90 24.51,22.3 24.61,22.3 arc90 24.77,22.45 24.77,22.48 arc-90 24.92,22.63 24.99,22.63 arc-90 25.15,22.48 25.15,22.4 arc90 25.3,22.25 25.38,22.25 arc90 25.53,22.4 25.53,22.48 arc-90 25.68,22.63 25.76,22.63 arc-90 25.91,22.48 25.91,22.4 arc90 26.06,22.25 26.14,22.25 arc90 26.29,22.4 26.29,22.48 arc-90 26.44,22.63 26.52,22.63 arc-90 26.67,22.48 26.67,22.4 arc90 26.82,22.25 26.9,22.25 arc90 27.05,22.4 27.05,22.48 arc-90 27.2,22.63 27.28,22.63 arc-90 27.43,22.48 27.43,22.4 arc90 27.58,22.25 27.66,22.25 arc90 27.81,22.4 27.81,22.48 arc-90 27.96,22.63 28.04,22.63 arc-90 28.19,22.48 28.19,22.4 arc90 28.35,22.25 28.42,22.25 arc90 28.57,22.4 28.57,22.48 arc-90 28.73,22.63 28.8,22.63 arc-90 28.96,22.48 28.96,22.4 arc90 29.11,22.25 29.18,22.25 arc90 29.34,22.4 29.34,22.48 arc-90 29.49,22.63 29.57,22.63 arc-90 29.72,22.48 29.72,22.4 arc90 29.87,22.25 29.95,22.25 arc90 30.1,22.4 30.1,22.48 arc-90 30.25,22.63 30.33,22.63 arc-90 30.48,22.48 30.48,22.4 arc90 30.63,22.25 30.71,22.25 arc90 30.86,22.4 30.86,22.48 arc-90 31.01,22.63 37.64,22.63 39.62,24.61 41.76,24.61 43.66,26.52 v44.15,26.52
A2  (via drill 0.3 pad 0.5)
  Top 0.152: U2.31 21.18,23.92 v21.26,24 | v43.76,25.86 43.94,25.86 44.2,25.6 U1.74
  Bottom 0.152: v21.26,24 22.25,24 24.31,21.95 24.38,21.95 arc-90 24.54,21.79 24.54,21.72 arc90 24.69,21.57 24.77,21.57 arc90 24.92,21.72 24.92,21.79 arc-90 25.07,21.95 25.15,21.95 arc-90 25.3,21.79 25.3,21.72 arc90 25.45,21.57 25.53,21.57 arc90 25.68,21.72 25.68,21.79 arc-90 25.83,21.95 25.91,21.95 arc-90 26.06,21.79 26.06,21.72 arc90 26.21,21.57 26.29,21.57 arc90 26.44,21.72 26.44,21.79 arc-90 26.59,21.95 26.67,21.95 arc-90 26.82,21.79 26.82,21.72 arc90 26.98,21.57 27.05,21.57 arc90 27.2,21.72 27.2,21.79 arc-90 27.36,21.95 27.43,21.95 arc-90 27.58,21.79 27.58,21.72 arc90 27.74,21.57 27.81,21.57 arc90 27.96,21.72 27.96,21.79 arc-90 28.12,21.95 28.19,21.95 arc-90 28.35,21.79 28.35,21.72 arc90 28.5,21.57 28.57,21.57 arc90 28.73,21.72 28.73,21.79 arc-90 28.88,21.95 28.96,21.95 arc-90 29.11,21.79 29.11,21.72 arc90 29.26,21.57 29.34,21.57 arc90 29.49,21.72 29.49,21.79 arc-90 29.64,21.95 29.72,21.95 arc-90 29.87,21.79 29.87,21.72 arc90 30.02,21.57 30.1,21.57 arc90 30.25,21.72 30.25,21.79 arc-90 30.4,21.95 30.48,21.95 arc-90 30.63,21.79 30.63,21.72 arc90 30.79,21.57 30.86,21.57 arc90 31.01,21.72 31.01,21.82 arc-90 31.17,21.97 31.24,21.97 arc-90 31.39,21.82 31.39,21.72 arc90 31.55,21.57 31.62,21.57 arc90 31.77,21.72 31.77,22.15 arc-90 31.95,22.33 37.8,22.33 39.78,24.31 41.91,24.31 43.46,25.86 v43.76,25.86
A3  (via drill 0.3 pad 0.5)
  Top 0.152: U2.32 21.67,23.27 v21.87,23.47 | U1.73 43.8,23.79 44.2,23.39 v44.42,23.39
  Bottom 0.152: v21.87,23.47 22.25,23.47 24.46,21.26 24.92,21.26 arc-90 25.07,21.11 25.07,21.03 arc90 25.22,20.88 25.3,20.88 arc90 25.45,21.03 25.45,21.11 arc-90 25.6,21.26 25.68,21.26 arc-90 25.83,21.11 25.83,21.03 arc90 25.98,20.88 26.06,20.88 arc90 26.21,21.03 26.21,21.11 arc-90 26.36,21.26 26.44,21.26 arc-90 26.59,21.11 26.59,21.03 arc90 26.75,20.88 26.82,20.88 arc90 26.98,21.03 26.98,21.11 arc-90 27.13,21.26 27.2,21.26 arc-90 27.36,21.11 27.36,21.03 arc90 27.51,20.88 27.58,20.88 arc90 27.74,21.03 27.74,21.11 arc-90 27.89,21.26 27.96,21.26 arc-90 28.12,21.11 28.12,21.03 arc90 28.27,20.88 28.35,20.88 arc90 28.5,21.03 28.5,21.11 arc-90 28.65,21.26 28.73,21.26 arc-90 28.88,21.11 28.88,21.03 arc90 29.03,20.88 29.11,20.88 arc90 29.26,21.03 29.26,21.11 arc-90 29.41,21.26 29.49,21.26 arc-90 29.64,21.11 29.64,21.03 arc90 29.79,20.88 29.87,20.88 arc90 30.02,21.03 30.02,21.11 arc-90 30.18,21.26 30.25,21.26 arc-90 30.4,21.11 30.4,21.03 arc90 30.56,20.88 30.63,20.88 arc90 30.79,21.03 30.79,21.11 arc-90 30.94,21.26 31.01,21.26 arc-90 31.17,21.11 31.17,21.03 arc90 31.32,20.88 31.39,20.88 arc90 31.55,21.03 31.55,21.11 arc-90 31.7,21.26 31.85,21.26 arc90 32.08,21.49 32.08,21.54 arc-45 32.16,21.71 32.39,21.95 arc-45 32.57,22.02 37.95,22.02 39.93,24 43.81,24 v44.42,23.39
A4  (via drill 0.3 pad 0.5)
  Top 0.152: U2.35 31.14,23.27 v30.02,24.38 | U1.72 43.4,23.74 43.89,23.25 v43.89,22.78
  Route2 0.152: v30.02,24.38 30.02,20.42 31.75,18.69 38.46,18.69 arc90 38.61,18.85 38.61,19.28 arc-90 38.76,19.43 38.84,19.43 arc-90 38.99,19.28 38.99,18.85 arc90 39.14,18.69 39.22,18.69 arc90 39.37,18.85 39.37,19.28 arc-90 39.52,19.43 39.6,19.43 arc-90 39.75,19.28 39.75,18.85 arc90 39.9,18.69 39.98,18.69 arc90 40.13,18.85 40.13,19.28 arc-90 40.28,19.43 40.36,19.43 arc-90 40.51,19.28 40.51,18.85 arc90 40.66,18.69 40.74,18.69 arc90 40.89,18.85 40.89,19.28 arc-90 41.05,19.43 41.12,19.43 arc-90 41.27,19.28 41.27,18.87 arc90 41.43,18.72 41.5,18.72 arc90 41.66,18.87 41.66,19.28 arc-90 41.81,19.43 41.88,19.43 arc-90 42.04,19.28 42.04,18.9 arc90 42.22,18.72 43.69,18.72 arc90 43.89,18.92 v43.89,22.78
A5  (via drill 0.3 pad 0.5)
  Top 0.152: U2.36 31.24,23.93 v30.79,24.38 | v43.2,23.16 43,23.37 U1.71
  Route2 0.152: v43.2,23.16 43.33,23.04 43.33,20.17 42.9,19.74 38.48,19.74 arc90 38.3,19.56 38.3,19.2 arc-90 38.15,19.05 38.06,19.05 arc-90 37.91,19.2 37.91,19.53 arc90 37.76,19.68 37.68,19.68 arc90 37.53,19.53 37.53,19.18 arc-90 37.38,19.02 37.3,19.02 arc-90 37.15,19.18 37.15,19.56 arc90 37,19.71 36.92,19.71 arc90 36.77,19.56 36.77,19.18 arc-90 36.62,19.02 36.54,19.02 arc-90 36.39,19.18 36.39,19.56 arc90 36.23,19.71 36.16,19.71 arc90 36.01,19.56 36.01,19.18 arc-90 35.85,19.02 35.78,19.02 arc-90 35.62,19.18 35.62,19.56 arc90 35.47,19.71 35.4,19.71 arc90 35.24,19.56 35.24,19.18 arc-90 35.09,19.02 35.02,19.02 arc-90 34.86,19.18 34.86,19.56 arc90 34.71,19.71 34.63,19.71 arc90 34.48,19.56 34.48,19.18 arc-90 34.33,19.02 34.25,19.02 arc-90 34.1,19.18 34.1,19.56 arc90 33.95,19.71 33.87,19.71 arc90 33.72,19.56 33.72,19.18 arc-90 33.57,19.02 33.49,19.02 arc-90 33.34,19.18 33.34,19.56 arc90 33.19,19.71 33.11,19.71 arc90 32.96,19.56 32.96,19.18 arc-90 32.81,19.02 32.73,19.02 arc-90 32.58,19.18 32.58,19.56 arc90 32.42,19.71 32.35,19.71 arc90 32.2,19.56 32.2,19.2 arc-90 32.04,19.05 31.97,19.05 arc-90 31.82,19.2 31.82,19.56 arc90 31.66,19.71 31.27,19.71 30.79,20.19 v30.79,24.38
A6  (via drill 0.3 pad 0.5)
  Top 0.152: U2.37 31.36,24.57 31.01,24.92 30.25,24.92 v30.02,25.15 | U1.70 v42.6,22.64 v42.6,22.63
  Route2 0.152: v30.02,25.15 30.25,24.92 31.01,24.92 31.32,24.61 31.32,20.22 arc90 31.52,20.02 31.67,20.02 arc90 31.83,20.17 31.83,20.75 arc-90 31.98,20.9 32.05,20.9 arc-90 32.21,20.75 32.21,20.17 arc90 32.36,20.02 32.56,20.02 arc90 32.72,20.17 32.72,20.34 arc-90 32.87,20.5 32.94,20.5 arc-90 33.1,20.34 33.1,20.17 arc90 33.25,20.02 33.33,20.02 arc90 33.48,20.17 33.48,20.34 arc-90 33.63,20.5 33.71,20.5 arc-90 33.86,20.34 33.86,20.17 arc90 34.01,20.02 34.09,20.02 arc90 34.24,20.17 34.24,20.34 arc-90 34.39,20.5 34.47,20.5 arc-90 34.62,20.34 34.62,20.17 arc90 34.77,20.02 34.85,20.02 arc90 35,20.17 35,20.34 arc-90 35.15,20.5 35.23,20.5 arc-90 35.38,20.34 35.38,20.17 arc90 35.53,20.02 35.61,20.02 arc90 35.76,20.17 35.76,20.34 arc-90 35.92,20.5 35.99,20.5 arc-90 36.14,20.34 36.14,20.17 arc90 36.3,20.02 36.37,20.02 arc90 36.52,20.17 36.52,20.34 arc-90 36.68,20.5 36.75,20.5 arc-90 36.91,20.34 36.91,20.17 arc90 37.06,20.02 37.13,20.02 arc90 37.29,20.17 37.29,20.34 arc-90 37.44,20.5 37.52,20.5 arc-90 37.67,20.34 37.67,20.14 arc90 37.82,19.99 37.9,19.99 arc90 38.05,20.14 38.05,20.32 arc-90 38.23,20.5 38.3,20.5 arc-90 38.48,20.32 38.48,20.19 arc90 38.63,20.04 38.71,20.04 arc90 38.86,20.19 38.86,20.34 arc-90 39.01,20.5 39.09,20.5 arc-90 39.24,20.34 39.24,20.19 arc90 39.4,20.04 39.47,20.04 arc90 39.62,20.19 39.62,20.34 arc-90 39.78,20.5 39.85,20.5 arc-90 40.01,20.34 40.01,20.19 arc90 40.16,20.04 40.23,20.04 arc90 40.39,20.19 40.39,20.34 arc-90 40.54,20.5 40.62,20.5 arc-90 40.77,20.34 40.77,20.19 arc90 40.92,20.04 42.19,20.04 42.6,20.45 v42.6,22.63
A7  (via drill 0.3 pad 0.5)
  Top 0.152: U2.38 31.88,25.3 30.94,25.3 v30.79,25.45 | v42.06,23.24 42.2,23.38 U1.69
  Route2 0.152: v30.79,25.45 30.94,25.45 31.62,24.77 31.62,21.49 arc90 31.85,21.26 31.95,21.26 arc90 32.16,21.46 32.16,21.95 arc-90 32.31,22.1 32.38,22.1 arc-90 32.54,21.95 32.54,20.95 arc90 32.69,20.8 32.77,20.8 arc90 32.92,20.95 32.92,21.18 arc-90 33.07,21.34 33.15,21.34 arc-90 33.3,21.18 33.3,20.95 arc90 33.45,20.8 33.53,20.8 arc90 33.68,20.95 33.68,21.18 arc-90 33.83,21.34 33.91,21.34 arc-90 34.06,21.18 34.06,20.95 arc90 34.21,20.8 34.29,20.8 arc90 34.44,20.95 34.44,21.18 arc-90 34.59,21.34 34.67,21.34 arc-90 34.82,21.18 34.82,20.95 arc90 34.98,20.8 35.05,20.8 arc90 35.2,20.95 35.2,21.18 arc-90 35.36,21.34 35.43,21.34 arc-90 35.59,21.18 35.59,20.95 arc90 35.74,20.8 35.81,20.8 arc90 35.97,20.95 35.97,21.18 arc-90 36.12,21.34 36.2,21.34 arc-90 36.35,21.18 36.35,20.95 arc90 36.5,20.8 36.58,20.8 arc90 36.73,20.95 36.73,21.18 arc-90 36.88,21.34 36.96,21.34 arc-90 37.11,21.18 37.11,20.95 arc90 37.26,20.8 37.34,20.8 arc90 37.49,20.95 37.49,21.18 arc-90 37.64,21.34 37.72,21.34 arc-90 37.87,21.18 37.87,20.95 arc90 38.02,20.8 38.1,20.8 arc90 38.25,20.95 38.25,21.18 arc-90 38.41,21.34 38.48,21.34 arc-90 38.63,21.18 38.63,20.95 arc90 38.79,20.8 38.86,20.8 arc90 39.01,20.95 39.01,21.18 arc-90 39.17,21.34 39.24,21.34 arc-90 39.4,21.18 39.4,20.95 arc90 39.55,20.8 39.62,20.8 arc90 39.78,20.95 39.78,21.18 arc-90 39.93,21.34 40.01,21.34 arc-90 40.16,21.18 40.16,20.95 arc90 40.31,20.8 40.39,20.8 arc90 40.54,20.95 40.54,21.18 arc-90 40.69,21.34 40.77,21.34 arc-90 40.92,21.18 40.92,20.86 arc90 41.07,20.7 41.15,20.7 arc90 41.3,20.86 41.3,22.12 arc-90 41.45,22.27 41.53,22.27 arc-90 41.68,22.12 41.68,21.51 arc90 41.83,21.36 41.91,21.36 arc90 42.06,21.51 42.06,22.4 arc90 41.91,22.55 41.83,22.55 arc-90 41.68,22.71 41.68,22.86 v42.06,23.24
A8  (via drill 0.3 pad 0.5)
  Top 0.152: U2.39 31.85,25.98 v30.18,25.98 | v40.97,22.63 41.45,23.11 41.45,23.39 41.8,23.74 U1.68
  Route2 0.152: v30.18,25.98 31.01,25.98 31.93,25.07 31.93,22.81 32.33,22.4 32.66,22.4 arc-90 32.84,22.23 32.84,21.79 arc90 32.99,21.64 33.07,21.64 arc90 33.22,21.79 33.22,22.25 arc-90 33.38,22.4 33.45,22.4 arc-90 33.6,22.25 33.6,21.79 arc90 33.76,21.64 33.83,21.64 arc90 33.98,21.79 33.98,22.25 arc-90 34.14,22.4 34.21,22.4 arc-90 34.37,22.25 34.37,21.79 arc90 34.52,21.64 34.59,21.64 arc90 34.75,21.79 34.75,22.25 arc-90 34.9,22.4 34.98,22.4 arc-90 35.13,22.25 35.13,21.79 arc90 35.28,21.64 35.36,21.64 arc90 35.51,21.79 35.51,22.33 arc-90 35.66,22.48 35.74,22.48 arc-90 35.89,22.33 35.89,21.79 arc90 36.04,21.64 36.12,21.64 arc90 36.27,21.79 36.27,22.33 arc-90 36.42,22.48 36.5,22.48 arc-90 36.65,22.33 36.65,21.79 arc90 36.8,21.64 36.88,21.64 arc90 37.03,21.79 37.03,22.33 arc-90 37.19,22.48 37.26,22.48 arc-90 37.41,22.33 37.41,21.79 arc90 37.57,21.64 37.64,21.64 arc90 37.8,21.79 37.8,22.33 arc-90 37.95,22.48 38.02,22.48 arc-90 38.18,22.33 38.18,21.79 arc90 38.33,21.64 38.41,21.64 arc90 38.56,21.79 38.56,22.33 arc-90 38.71,22.48 38.79,22.48 arc-90 38.94,22.33 38.94,21.79 arc90 39.09,21.64 39.17,21.64 arc90 39.32,21.79 39.32,22.33 arc-90 39.47,22.48 39.55,22.48 arc-90 39.7,22.33 39.7,21.79 arc90 39.85,21.64 39.93,21.64 arc90 40.08,21.79 40.08,22.33 arc-90 40.23,22.48 40.31,22.48 arc-90 40.46,22.33 40.46,21.79 arc90 40.62,21.64 40.69,21.64 arc90 40.84,21.79 40.84,22.5 v40.97,22.63
A9  (via drill 0.3 pad 0.5)
  Top 0.152: U2.40 v30.79,26.52 | v40.92,23.39 41,23.39 41.4,23.8 U1.67
  Route2 0.152: v30.79,26.52 31.09,26.52 32.23,25.38 32.23,24.08 32.46,23.85 32.59,23.85 arc-90 32.77,23.67 32.77,22.86 arc90 32.92,22.71 32.99,22.71 arc90 33.15,22.86 33.15,23.7 arc-90 33.3,23.85 33.38,23.85 arc-90 33.53,23.7 33.53,22.86 arc90 33.68,22.71 33.76,22.71 arc90 33.91,22.86 33.91,23.7 arc-90 34.06,23.85 34.14,23.85 arc-90 34.29,23.7 34.29,22.86 arc90 34.44,22.71 34.52,22.71 arc90 34.67,22.86 34.67,23.7 arc-90 34.82,23.85 34.9,23.85 arc-90 35.05,23.7 35.05,22.86 arc90 35.2,22.71 35.28,22.71 arc90 35.43,22.86 35.43,23.7 arc-90 35.59,23.85 35.66,23.85 arc-90 35.81,23.7 35.81,22.94 arc90 35.97,22.78 36.04,22.78 arc90 36.2,22.94 36.2,23.7 arc-90 36.35,23.85 36.42,23.85 arc-90 36.58,23.7 36.58,22.94 arc90 36.73,22.78 36.8,22.78 arc90 36.96,22.94 36.96,23.7 arc-90 37.11,23.85 37.19,23.85 arc-90 37.34,23.7 37.34,22.94 arc90 37.49,22.78 37.57,22.78 arc90 37.72,22.94 37.72,23.7 arc-90 37.87,23.85 37.95,23.85 arc-90 38.1,23.7 38.1,22.94 arc90 38.25,22.78 38.33,22.78 arc90 38.48,22.94 38.48,23.7 arc-90 38.63,23.85 38.71,23.85 arc-90 38.86,23.7 38.86,22.94 arc90 39.01,22.78 39.09,22.78 arc90 39.24,22.94 39.24,23.55 arc-90 39.4,23.7 39.47,23.7 arc-90 39.62,23.55 39.62,22.99 arc90 39.8,22.81 40.34,22.81 v40.92,23.39
A10  (via drill 0.3 pad 0.5)
  Top 0.152: U2.28 21.91,25.87 v22.48,26.44 | U1.66 41,25.99 v41.07,26.06
  Bottom 0.152: v22.48,26.44 22.48,26.06 24.23,24.31 29.03,24.31 29.49,23.85 31.06,23.85 arc90 31.32,24.11 31.32,24.43 arc-90 31.47,24.59 31.55,24.59 arc-90 31.7,24.43 31.7,24 arc90 31.85,23.85 31.93,23.85 arc90 32.08,24 32.08,24.38 arc-90 32.23,24.54 32.31,24.54 arc-90 32.46,24.38 32.46,24 arc90 32.61,23.85 32.69,23.85 arc90 32.84,24 32.84,24.38 arc-90 32.99,24.54 33.07,24.54 arc-90 33.22,24.38 33.22,24 arc90 33.38,23.85 33.45,23.85 arc90 33.6,24 33.6,24.38 arc-90 33.76,24.54 33.83,24.54 arc-90 33.98,24.38 33.98,24 arc90 34.14,23.85 34.21,23.85 arc90 34.37,24 34.37,24.38 arc-90 34.52,24.54 34.59,24.54 arc-90 34.75,24.38 34.75,24 arc90 34.9,23.85 34.98,23.85 arc90 35.13,24 35.13,24.38 arc-90 35.28,24.54 35.36,24.54 arc-90 35.51,24.38 35.51,24 arc90 35.66,23.85 35.74,23.85 arc90 35.89,24 35.89,24.38 arc-90 36.04,24.54 36.12,24.54 arc-90 36.27,24.38 36.27,24 arc90 36.42,23.85 36.5,23.85 arc90 36.65,24 36.65,24.31 arc-90 36.88,24.54 37.72,24.54 39.01,25.83 40.84,25.83 v41.07,26.06
A11  (via drill 0.3 pad 0.5)
  Top 0.152: U2.41 31.84,27.05 v30.18,27.05 | U1.65 40.6,23.91 v40.16,23.47
  Route2 0.152: v30.18,27.05 31.01,27.05 32.54,25.53 32.54,24.31 arc90 32.69,24.16 32.77,24.16 arc90 32.92,24.31 32.92,24.99 arc-90 33.07,25.15 33.15,25.15 arc-90 33.3,24.99 33.3,24.31 arc90 33.45,24.16 33.53,24.16 arc90 33.68,24.31 33.68,24.99 arc-90 33.83,25.15 33.91,25.15 arc-90 34.06,24.99 34.06,24.31 arc90 34.21,24.16 34.29,24.16 arc90 34.44,24.31 34.44,24.99 arc-90 34.59,25.15 34.67,25.15 arc-90 34.82,24.99 34.82,24.31 arc90 34.98,24.16 35.05,24.16 arc90 35.2,24.31 35.2,24.99 arc-90 35.36,25.15 35.43,25.15 arc-90 35.59,24.99 35.59,24.31 arc90 35.74,24.16 35.81,24.16 arc90 35.97,24.31 35.97,24.99 arc-90 36.12,25.15 36.2,25.15 arc-90 36.35,24.99 36.35,24.31 arc90 36.5,24.16 36.58,24.16 arc90 36.73,24.31 36.73,24.92 arc-90 36.88,25.07 36.96,25.07 arc-90 37.11,24.92 37.11,24.31 arc90 37.26,24.16 37.34,24.16 arc90 37.49,24.31 37.49,24.92 arc-90 37.64,25.07 37.72,25.07 arc-90 37.87,24.92 37.87,24.31 arc90 38.02,24.16 38.1,24.16 arc90 38.25,24.31 38.25,24.92 arc-90 38.41,25.07 38.48,25.07 arc-90 38.63,24.92 38.63,24.31 arc90 38.79,24.16 38.86,24.16 arc90 39.01,24.31 39.01,24.92 arc-90 39.17,25.07 39.24,25.07 arc-90 39.4,24.92 39.4,24.16 arc90 39.55,24 39.62,24 arc90 39.78,24.16 39.78,25.09 arc-90 39.93,25.25 40.01,25.25 arc-90 40.16,25.09 v40.16,23.47
A12  (via drill 0.3 pad 0.5)
  Top 0.152: U2.42 31.02,27.82 v30.79,27.58 | U1.64 40.12,26.18 v40.31,26.36
  Route2 0.152: v30.79,27.58 30.79,27.94 arc-90 30.94,28.09 31.19,28.09 arc-90 31.42,27.86 31.42,27.28 arc90 31.57,27.13 31.8,27.13 arc-90 31.95,27.28 32.03,27.28 arc-90 32.18,27.13 32.18,26.42 arc90 32.33,26.26 32.41,26.26 arc90 32.56,26.42 32.56,26.44 arc-90 32.72,26.59 32.79,26.59 arc-90 32.94,26.44 32.94,25.6 arc90 33.1,25.45 33.17,25.45 arc90 33.33,25.6 33.33,26.44 arc-90 33.48,26.59 33.55,26.59 arc-90 33.71,26.44 33.71,25.6 arc90 33.86,25.45 33.93,25.45 arc90 34.09,25.6 34.09,26.75 arc-90 34.24,26.9 34.31,26.9 arc-90 34.47,26.75 34.47,25.6 arc90 34.62,25.45 34.7,25.45 arc90 34.85,25.6 34.85,26.75 arc-90 35,26.9 35.08,26.9 arc-90 35.23,26.75 35.23,25.6 arc90 35.38,25.45 35.46,25.45 arc90 35.61,25.6 35.61,26.59 arc-90 35.76,26.75 35.84,26.75 arc-90 35.99,26.59 35.99,25.6 arc90 36.14,25.45 36.22,25.45 arc90 36.37,25.6 36.37,26.44 arc-90 36.52,26.59 36.6,26.59 arc-90 36.75,26.44 36.75,25.6 arc90 36.98,25.38 38.1,25.38 arc90 38.33,25.6 38.33,26.67 arc-90 38.48,26.82 38.56,26.82 arc-90 38.71,26.67 38.71,25.53 arc90 38.86,25.38 38.94,25.38 arc90 39.09,25.53 39.09,26.67 arc-90 39.24,26.82 39.32,26.82 arc-90 39.47,26.67 39.47,25.73 arc90 39.62,25.58 39.7,25.58 arc90 39.85,25.73 39.85,26.21 arc-90 40.01,26.36 v40.31,26.36
AUART1_RXD  (via drill 0.4 pad 0.8)
  Top 0.203: U1.128 54.1,38.58 v54.1,39.75
  Bottom 0.254: 72.77,50.55 72.39,50.16 72.39,47.88 72.01,47.5 70.1,47.5 66.93,44.32 61.98,44.32 59.56,41.91 56.64,41.91 54.48,39.75 v54.1,39.75
  Bottom 1.016: 72.77,50.55 UEXT135.4
AUART1_TXD  (via drill 0.4 pad 0.8)
  Top 0.203: U1.127 55.43,38.18 57.1,39.85 57.1,45.87 57.94,46.71 v58.93,46.71
  Route2 0.203: v58.93,46.71 59.05,46.58 71.35,46.58 72.87,48.11
  Route2 1.016: 72.87,48.11 UEXT135.3
BA0  (via drill 0.3 pad 0.5)
  Top 0.152: U2.26 21.6,27.17 v21.87,26.9 | U1.79 46.2,27.1 45.64,27.66 v45.64,28.04
  Bottom 0.152: v21.87,26.9 21.87,26.21 24.08,24 28.88,24 29.34,23.55 37.19,23.55 39.17,25.53 41.3,25.53 43.43,27.66 45.26,27.66 v45.64,28.04
BA1  (via drill 0.3 pad 0.5)
  Top 0.152: U2.27 21.18,26.52 v21.26,26.44 | U1.80 46.6,27.7 v46.43,27.86
  Bottom 0.152: v21.26,26.44 21.26,26.36 23.93,23.7 28.73,23.7 29.18,23.24 37.34,23.24 39.32,25.22 41.45,25.22 43.59,27.36 45.92,27.36 v46.43,27.86
CASN  (via drill 0.3 pad 0.5)
  Top 0.152: U2.22 20.13,29.79 v21.87,29.79 | U1.61 37.82,27.38 v37.64,27.2
  Bottom 0.152: v21.87,29.79 22.1,30.02 23.04,30.02 arc-90 23.24,29.82 23.24,29.06 arc90 23.42,28.88 23.44,28.88 arc90 23.62,29.06 23.62,29.9 arc-90 23.77,30.05 23.85,30.05 arc-90 24,29.9 24,29.03 arc90 24.16,28.88 24.23,28.88 arc90 24.38,29.03 24.38,29.87 arc-90 24.54,30.02 24.61,30.02 arc-90 24.77,29.87 24.77,29.03 arc90 24.92,28.88 24.99,28.88 arc90 25.15,29.03 25.15,29.87 arc-90 25.3,30.02 25.38,30.02 arc-90 25.53,29.87 25.53,29.06 arc90 25.68,28.91 25.76,28.91 arc90 25.91,29.06 25.91,29.87 arc-90 26.06,30.02 26.14,30.02 arc-90 26.29,29.87 26.29,29.11 arc90 26.44,28.96 26.52,28.96 arc90 26.67,29.11 26.67,29.87 arc-90 26.82,30.02 26.9,30.02 arc-90 27.05,29.87 27.05,29.11 arc90 27.2,28.96 27.28,28.96 arc90 27.43,29.11 27.43,29.87 arc-90 27.58,30.02 27.66,30.02 arc-90 27.81,29.87 27.81,29.16 arc90 28.02,28.96 31.09,28.96 32.54,27.51 32.54,27.28 32.92,26.9 36.88,26.9 37.19,27.2 v37.64,27.2
CKE  (via drill 0.3 pad 0.5)
  Top 0.152: U1.78 45.8,27.07 45.29,27.58 43.89,27.58 43.51,27.2 v42.22,27.2 | U2.44 32.55,29.12 32.92,28.75 32.92,27.71 v33.15,27.48
  Route2 0.152: v42.22,27.2 41.99,27.43 41.99,28.25 arc90 41.83,28.4 41.76,28.4 arc90 41.6,28.25 41.6,27.36 arc-90 41.45,27.2 41.38,27.2 arc-90 41.22,27.36 41.22,27.43 arc90 41.07,27.58 41,27.58 arc90 40.84,27.43 40.84,27.36 arc-90 40.69,27.2 40.01,27.2 39.78,27.43 39.78,28.35 arc90 39.62,28.5 39.55,28.5 arc90 39.4,28.35 39.4,27.58 arc-90 39.24,27.43 39.17,27.43 arc-90 39.01,27.58 39.01,28.35 arc90 38.86,28.5 38.79,28.5 arc90 38.63,28.35 38.63,27.89 arc-90 38.48,27.74 38.41,27.74 arc-90 38.25,27.89 38.25,28.35 arc90 38.1,28.5 38.02,28.5 arc90 37.87,28.35 37.87,28.19 arc-90 37.72,28.04 37.64,28.04 arc-90 37.49,28.19 37.49,28.35 arc90 37.34,28.5 37.26,28.5 arc90 37.11,28.35 37.11,28.19 arc-90 36.96,28.04 36.91,28.04 arc-90 36.75,28.19 36.75,28.35 arc90 36.58,28.5 36.47,28.5 arc90 36.32,28.35 36.32,28.27 arc-90 36.17,28.12 36.12,28.12 arc-90 35.97,28.27 35.97,28.35 arc90 35.81,28.5 35.74,28.5 arc90 35.59,28.35 35.59,27.66 arc-90 35.43,27.51 35.36,27.51 arc-90 35.2,27.66 35.2,28.12 arc90 35.05,28.27 34.98,28.27 arc90 34.82,28.12 34.82,27.66 arc-90 34.67,27.51 34.59,27.51 arc-90 34.44,27.66 34.44,28.12 arc90 34.29,28.27 34.21,28.27 arc90 34.06,28.12 34.06,27.66 arc-90 33.91,27.51 33.83,27.51 arc-90 33.68,27.66 33.68,28.35 arc90 33.53,28.5 32.51,28.5 arc90 32.36,28.35 32.36,28.27 arc90 32.51,28.12 32.64,28.12 33.15,27.61 v33.15,27.48
CLK  (via drill 0.3 pad 0.5)
  Top 0.152: U1.36 43.07,37.38 43.26,37.57 43.74,37.57 44.27,37.03 v44.27,36.73 | U2.45 32.59,29.77 33.78,28.57 R17.2 34.14,28.8 v34.67,28.8
  Bottom 0.152: v44.27,36.73 44.27,36.42 45.26,35.43 45.26,31.24 44.88,30.86 44.88,28.57 arc-90 44.7,28.4 44.65,28.4 arc-90 44.5,28.55 44.5,29.49 arc90 44.35,29.64 44.27,29.64 arc90 44.12,29.49 44.12,28.5 arc-90 43.97,28.35 43.89,28.35 arc-90 43.74,28.5 43.74,28.73 arc90 43.59,28.88 43.51,28.88 arc90 43.36,28.73 43.36,28.25 43,27.89 42.06,27.89 41.07,26.9 39.85,26.9 38.41,28.35 35.13,28.35 v34.67,28.8
CLKN  (via drill 0.3 pad 0.5)
  Top 0.152: U1.37 43.46,36.98 v43.51,37.03 | U2.46 33.59,30.42 R17.1 34.31,30.23 v34.67,29.87
  Bottom 0.152: v43.51,37.03 43.51,36.73 44.96,35.28 44.96,31.39 44.58,31.01 44.58,30.15 arc-90 44.37,29.95 arc-90 44.2,30.12 44.2,30.76 arc90 44.02,30.94 43.99,30.94 arc90 43.81,30.76 43.81,29.34 arc-90 43.66,29.18 43.59,29.18 arc-90 43.43,29.34 43.43,30.56 arc90 43.28,30.71 43.23,30.71 arc90 43.05,30.53 43.05,28.4 42.85,28.19 41.91,28.19 40.92,27.2 40.01,27.2 38.56,28.65 35.59,28.65 34.67,29.57 v34.67,29.87
CS  (via drill 0.3 pad 0.5)
  Top 0.152: U2.24 21.61,28.47 v21.87,28.73 | U1.63 38.24,26.58 37.8,26.14 v37.8,25.91
  Top 0.406: U2.24 18.29,28.47 R16.1
  Bottom 0.152: v21.87,28.73 22.1,28.73 23.39,27.43 23.62,27.43 arc-90 23.77,27.28 23.77,26.9 arc90 23.93,26.75 24,26.75 arc90 24.16,26.9 24.16,27.28 arc-90 24.31,27.43 24.38,27.43 arc-90 24.54,27.28 24.54,26.9 arc90 24.69,26.75 24.77,26.75 arc90 24.92,26.9 24.92,27.28 arc-90 25.07,27.43 25.15,27.43 arc-90 25.3,27.28 25.3,26.9 arc90 25.45,26.75 25.53,26.75 arc90 25.68,26.9 25.68,27.28 arc-90 25.83,27.43 25.91,27.43 arc-90 26.06,27.28 26.06,26.82 arc90 26.21,26.67 26.29,26.67 arc90 26.44,26.82 26.44,27.28 arc-90 26.59,27.43 26.67,27.43 arc-90 26.82,27.28 26.82,26.82 arc90 26.98,26.67 27.05,26.67 arc90 27.2,26.82 27.2,27.28 arc-90 27.36,27.43 27.43,27.43 arc-90 27.58,27.28 27.58,26.82 arc90 27.74,26.67 27.81,26.67 arc90 27.96,26.82 27.96,27.28 arc-90 28.12,27.43 28.19,27.43 arc-90 28.35,27.28 28.35,26.82 arc90 28.5,26.67 28.57,26.67 arc90 28.73,26.82 28.73,27.28 arc-90 28.88,27.43 28.96,27.43 arc-90 29.11,27.28 29.11,26.82 arc90 29.26,26.67 29.34,26.67 arc90 29.49,26.82 29.49,27.3 arc-90 29.62,27.43 29.79,27.43 30.48,28.12 31.06,28.12 31.93,27.25 31.93,26.98 32.61,26.29 36.73,26.29 37.11,25.91 v37.8,25.91
D0  (via drill 0.3 pad 0.5)
  Top 0.152: U2.2 21.24,42.77 v21.26,42.75 | U1.41 41.4,35.38 v41.55,35.53
  Route2 0.152: v21.26,42.75 21.26,42.29 28.27,35.28 32.16,35.28 32.61,34.82 34.21,34.82 arc90 34.37,34.98 34.37,35.13 arc-90 34.52,35.28 34.67,35.28 arc-90 34.82,35.13 34.82,34.75 arc90 34.98,34.59 35.05,34.59 arc90 35.2,34.75 35.2,35.13 arc-90 35.36,35.28 35.43,35.28 arc-90 35.59,35.13 35.59,34.75 arc90 35.74,34.59 35.81,34.59 arc90 35.97,34.75 35.97,35.13 arc-90 36.12,35.28 36.2,35.28 arc-90 36.35,35.13 36.35,34.75 arc90 36.5,34.59 38.33,34.59 arc90 38.48,34.75 38.48,35.13 arc-90 38.63,35.28 38.71,35.28 arc-90 38.86,35.13 38.86,34.75 arc90 39.01,34.59 39.09,34.59 arc90 39.24,34.75 39.24,34.98 arc-90 39.4,35.13 39.47,35.13 arc-90 39.62,34.98 39.62,34.9 arc90 39.78,34.75 39.85,34.75 arc90 40.01,34.9 40.01,35.13 arc-90 40.16,35.28 41.3,35.28 v41.55,35.53
D1  (via drill 0.3 pad 0.5)
  Top 0.152: U2.4 21.24,41.47 v21.26,41.45 | U1.43 40.93,34.58 v41.07,34.44
  Route2 0.152: v21.26,41.45 21.26,40.77 21.64,40.39 22.25,40.39 27.96,34.67 31.11,34.67 arc-90 31.32,34.47 31.32,34.29 arc90 31.47,34.14 31.55,34.14 arc90 31.7,34.29 31.7,34.37 arc-90 31.85,34.52 31.93,34.52 arc-90 32.08,34.37 32.08,33.45 arc90 32.23,33.3 32.31,33.3 arc90 32.46,33.45 32.46,34.06 arc-90 32.61,34.21 32.69,34.21 arc-90 32.84,34.06 32.84,33.45 arc90 32.99,33.3 33.07,33.3 arc90 33.22,33.45 33.22,34.06 arc-90 33.38,34.21 33.45,34.21 arc-90 33.6,34.06 33.6,33.45 arc90 33.76,33.3 33.83,33.3 arc90 33.98,33.45 33.98,34.06 arc-90 34.14,34.21 34.21,34.21 arc-90 34.37,34.06 34.37,33.6 arc90 34.52,33.45 39.4,33.45 40.01,34.06 40.54,34.06 40.92,34.44 v41.07,34.44
D2  (via drill 0.3 pad 0.5)
  Top 0.152: U2.5 21.77,40.82 v21.87,40.92 | U1.42 41.6,34.98 v41.83,34.75
  Route2 0.152: v21.87,40.92 22.17,40.92 28.12,34.98 32,34.98 32.46,34.52 34.44,34.52 arc-90 34.67,34.29 34.67,33.91 arc90 34.82,33.76 34.9,33.76 arc90 35.05,33.91 35.05,34.14 arc-90 35.2,34.29 35.28,34.29 arc-90 35.43,34.14 35.43,33.91 arc90 35.59,33.76 35.66,33.76 arc90 35.81,33.91 35.81,34.14 arc-90 35.97,34.29 36.04,34.29 arc-90 36.2,34.14 36.2,33.91 arc90 36.35,33.76 36.42,33.76 arc90 36.58,33.91 36.58,34.14 arc-90 36.73,34.29 36.88,34.29 arc-90 37.03,34.14 37.03,33.91 arc90 37.19,33.76 37.34,33.76 arc90 37.49,33.91 37.49,34.14 arc-90 37.64,34.29 37.8,34.29 arc-90 37.95,34.14 37.95,33.91 arc90 38.1,33.76 38.25,33.76 arc90 38.41,33.91 38.41,34.14 arc-90 38.56,34.29 38.71,34.29 arc-90 38.86,34.14 38.86,33.91 arc90 39.01,33.76 39.17,33.76 arc90 39.32,33.91 39.32,34.14 arc-90 39.55,34.37 40.31,34.37 arc90 40.46,34.52 40.46,34.82 arc-90 40.62,34.98 41.6,34.98 v41.83,34.75
D3  (via drill 0.3 pad 0.5)
  Top 0.152: U2.7 21.82,39.52 v21.87,39.47 | U1.44 40.5,34.18 v41,33.68
  Route2 0.152: v21.87,39.47 21.87,38.71 27.89,32.69 33.83,32.69 34.29,32.23 34.44,32.23 arc90 34.59,32.38 34.59,32.69 arc-90 34.75,32.84 34.82,32.84 arc-90 34.98,32.69 34.98,32.38 arc90 35.13,32.23 35.2,32.23 arc90 35.36,32.38 35.36,32.69 arc-90 35.51,32.84 35.59,32.84 arc-90 35.74,32.69 35.74,32.38 arc90 35.89,32.23 35.97,32.23 arc90 36.12,32.38 36.12,32.69 arc-90 36.27,32.84 36.35,32.84 arc-90 36.5,32.69 36.5,32.38 arc90 36.65,32.23 36.73,32.23 arc90 36.88,32.38 36.88,32.69 arc-90 37.03,32.84 37.11,32.84 arc-90 37.26,32.69 37.26,32.38 arc90 37.41,32.23 37.49,32.23 arc90 37.64,32.38 37.64,32.69 arc-90 37.8,32.84 37.87,32.84 arc-90 38.02,32.69 38.02,32.38 arc90 38.18,32.23 38.25,32.23 arc90 38.41,32.38 38.41,32.69 arc-90 38.56,32.84 38.63,32.84 arc-90 38.79,32.69 38.79,32.38 arc90 38.94,32.23 39.17,32.23 39.93,32.99 40.46,32.99 41,33.53 v41,33.68
D4  (via drill 0.3 pad 0.5)
  Top 0.152: U2.8 21.19,38.87 v21.26,38.94 | U1.47 41.29,32.98 v41.76,33.45
  Route2 0.152: v21.26,38.94 21.18,38.94 27.81,32.31 31.93,32.31 arc-90 32.16,32.08 32.16,31.62 arc90 32.31,31.47 32.38,31.47 arc90 32.54,31.62 32.54,32.23 arc-90 32.69,32.38 32.77,32.38 arc-90 32.92,32.23 32.92,31.47 arc90 33.07,31.32 33.15,31.32 arc90 33.3,31.47 33.3,32.23 arc-90 33.45,32.38 33.53,32.38 arc-90 33.68,32.23 33.68,31.47 arc90 33.83,31.32 33.91,31.32 arc90 34.06,31.47 34.06,31.77 arc-90 34.21,31.93 39.32,31.93 40.08,32.69 41.15,32.69 41.76,33.3 v41.76,33.45
D5  (via drill 0.3 pad 0.5)
  Top 0.152: U2.10 21.79,37.57 v21.87,37.49 | U1.48 41.8,32.58 v42.52,33.3
  Route2 0.152: v21.87,37.49 22.17,37.49 27.66,32 31.27,32 32.26,31.01 34.21,31.01 arc90 34.37,31.17 34.37,31.47 arc-90 34.52,31.62 34.59,31.62 arc-90 34.75,31.47 34.75,31.17 arc90 34.9,31.01 34.98,31.01 arc90 35.13,31.17 35.13,31.47 arc-90 35.28,31.62 35.36,31.62 arc-90 35.51,31.47 35.51,31.17 arc90 35.66,31.01 35.74,31.01 arc90 35.89,31.17 35.89,31.47 arc-90 36.04,31.62 36.12,31.62 arc-90 36.27,31.47 36.27,31.17 arc90 36.42,31.01 36.5,31.01 arc90 36.65,31.17 36.65,31.37 arc-90 36.91,31.62 39.47,31.62 40.23,32.38 41.68,32.38 42.52,33.22 v42.52,33.3
D6  (via drill 0.3 pad 0.5)
  Top 0.152: U2.11 21.22,36.92 v21.26,36.96 | v42.9,32.61 42.47,32.18 U1.49
  Route2 0.152: v21.26,36.96 22.25,36.96 27.51,31.7 31.14,31.7 32.13,30.71 36.8,30.71 arc90 36.96,30.86 36.96,31.17 arc-90 37.11,31.32 37.19,31.32 arc-90 37.34,31.17 37.34,30.86 arc90 37.49,30.71 37.57,30.71 arc90 37.72,30.86 37.72,31.17 arc-90 37.87,31.32 37.95,31.32 arc-90 38.1,31.17 38.1,30.86 arc90 38.25,30.71 38.33,30.71 arc90 38.48,30.86 38.48,31.17 arc-90 38.63,31.32 38.71,31.32 arc-90 38.86,31.17 38.86,30.96 arc90 39.01,30.81 39.12,30.81 40.39,32.08 42.37,32.08 v42.9,32.61
D7  (via drill 0.3 pad 0.5)
  Top 0.152: U2.13 21.15,35.62 v21.26,35.51 | U1.50 41.6,31.78 v41.83,31.55